# Altium project servo motor board.PrjPcb
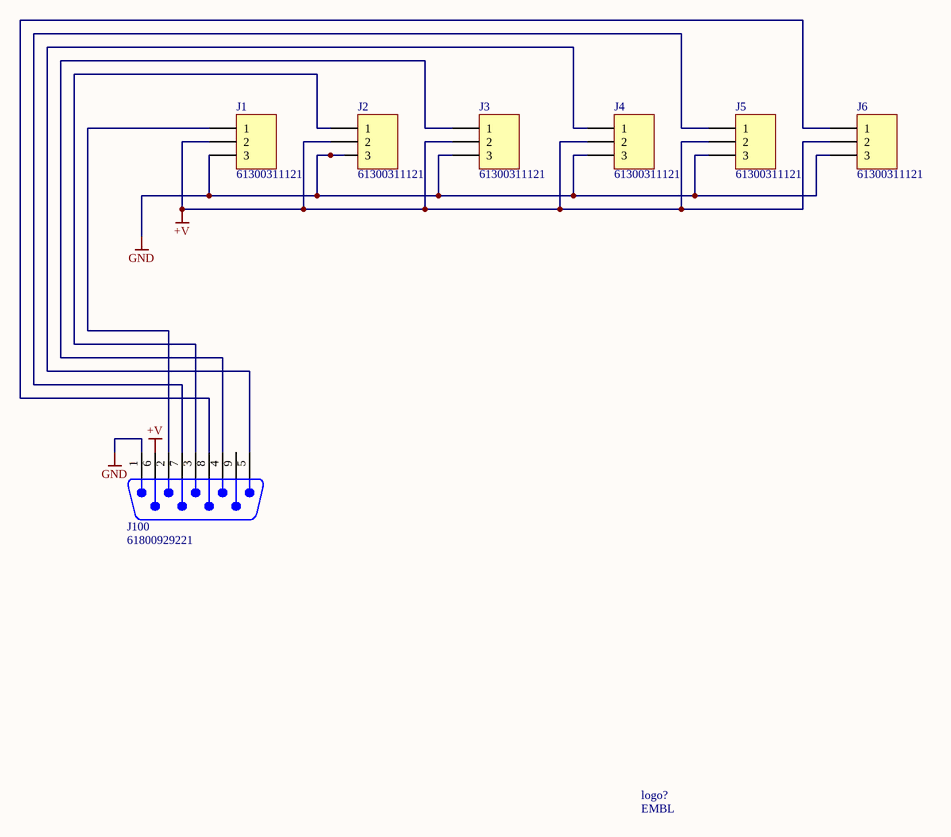
[diagram p0: Sheet_Power.SchDoc]
1 sheet, 8 parts. Net scope: global (net labels, ports and power ports of the same name join across sheets).
Board file: mainboard.PCBDOC

## Sheet Sheet_Power.SchDoc
size A4

### Parts
J1  61300311121  [61300311121]
J2  61300311121  [61300311121]
J3  61300311121  [61300311121]
J4  61300311121  [61300311121]
J5  61300311121  [61300311121]
J6  61300311121  [61300311121]
J100  61800929221  [PCBComponent]
logo?  EMBL  [EMBL]

### Nets
+V: J1.2 J2.2 J3.2 J4.2 J5.2 J6.2 J100.6
GND: J1.3 J2.3 J3.3 J4.3 J5.3 J6.3 J100.1
NetJ1_1: J1.1 J100.2
NetJ2_1: J2.1 J100.3
NetJ3_1: J3.1 J100.4
NetJ4_1: J4.1 J100.5
NetJ5_1: J5.1 J100.7
NetJ6_1: J6.1 J100.8

Not connected (* = marked no-connect by the designer): J100 9

### Library data of the parts
J1-J6 = CMP-001-0072-1: 3Pol; gerade; WR-PHD 2.54 mm THT Pin Header; Brand: Wurth Electronics; Current Rating: 3 A; Insulation Resistance: 1 GOhms; Mating Post Length: 6 mm; Mounting Angle: Straight; Number of Positions: 3 Position; Pitch: 2.54 mm; Voltage Rating: 250 V; ComponentLink1Description: 6130xx11121-538006.pdf; ComponentLink1URL: http://www.mouser.com/ds/2/445/6130xx11121-538006.pdf; Contact Gender: Pin (Male); Contact Material: Copper Alloy; Contact Plating: Gold; Contact Type: -; Flammability Rating: UL 94 V-0; Housing Gender: -; Housing Material: Polyamide (PA); Manufacturer: Wurth Electronics; Manufacturer Part Number: 61300311121; Minimum Order Quantity: 1; Mounting Style: Straight Pin; Number of Rows: 1 Row; Packaging: Bulk; Product: Headers; Reeling: False; RoHS - Mouser: Y; Row Spacing: -; Series: WR-PHD; Standard Pack Qty: 1000; Supplier: Mouser; Supplier Part Number: 710-61300311121; Termination Post Length: 3 mm; Termination Style: Through Hole; Type: Pin Strip; PartNumber: 61300311121
J100 = CMP-001-0130-A.1: 61800929221 / 9pol; PartNumber: 61800929221
logo? = EMBL gebembel